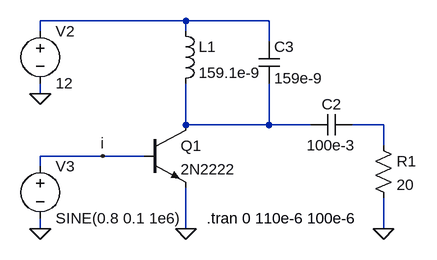
[diagram p0: schematic claseA_BJT.asc]
claseA_BJT.asc, the LTspice schematic file:
Version 4
SHEET 1 1020 680
WIRE 176 -32 -48 -32
WIRE 304 -32 176 -32
WIRE -48 -16 -48 -32
WIRE 176 -16 176 -32
WIRE 304 0 304 -32
WIRE -48 80 -48 64
WIRE 176 128 176 64
WIRE 304 128 304 64
WIRE 304 128 176 128
WIRE 368 128 304 128
WIRE 480 128 432 128
WIRE 480 160 480 128
WIRE 48 176 -48 176
WIRE 112 176 48 176
WIRE -48 192 -48 176
WIRE -48 288 -48 272
WIRE 176 288 176 224
WIRE 480 288 480 240
FLAG 176 288 0
FLAG -48 288 0
FLAG -48 80 0
FLAG 48 176 i
FLAG 480 288 0
SYMBOL npn 112 128 R0
SYMATTR InstName Q1
SYMATTR Value 2N2222
SYMBOL voltage -48 -32 R0
SYMATTR InstName V2
SYMATTR Value 12
SYMBOL res 464 144 R0
SYMATTR InstName R1
SYMATTR Value 20
SYMBOL cap 432 112 R90
WINDOW 0 0 32 VBottom 2
WINDOW 3 32 32 VTop 2
SYMATTR InstName C2
SYMATTR Value 100e-3
SYMBOL voltage -48 176 R0
WINDOW 123 0 0 Left 2
WINDOW 39 0 0 Left 2
SYMATTR InstName V3
SYMATTR Value SINE(0.8 0.1 1e6)
SYMBOL ind 160 -32 R0
SYMATTR InstName L1
SYMATTR Value 159.1e-9
SYMBOL cap 288 0 R0
SYMATTR InstName C3
SYMATTR Value 159e-9
TEXT 208 272 Left 2 !.tran 0 110e-6 100e-6

The netlist it stands for:
* claseA_BJT.asc
Q1 N002 i 0 0 2N2222
V2 N001 0 12
R1 N003 0 20
C2 N003 N002 100e-3
V3 i 0 SINE(0.8 0.1 1e6)
L1 N001 N002 159.1e-9
C3 N001 N002 159e-9
.model NPN NPN
.model PNP PNP
.lib standard.bjt
.tran 0 110e-6 100e-6
.backanno
.end